# EAGLE schematic VS1053_Demo (EAGLE 9.5.1)
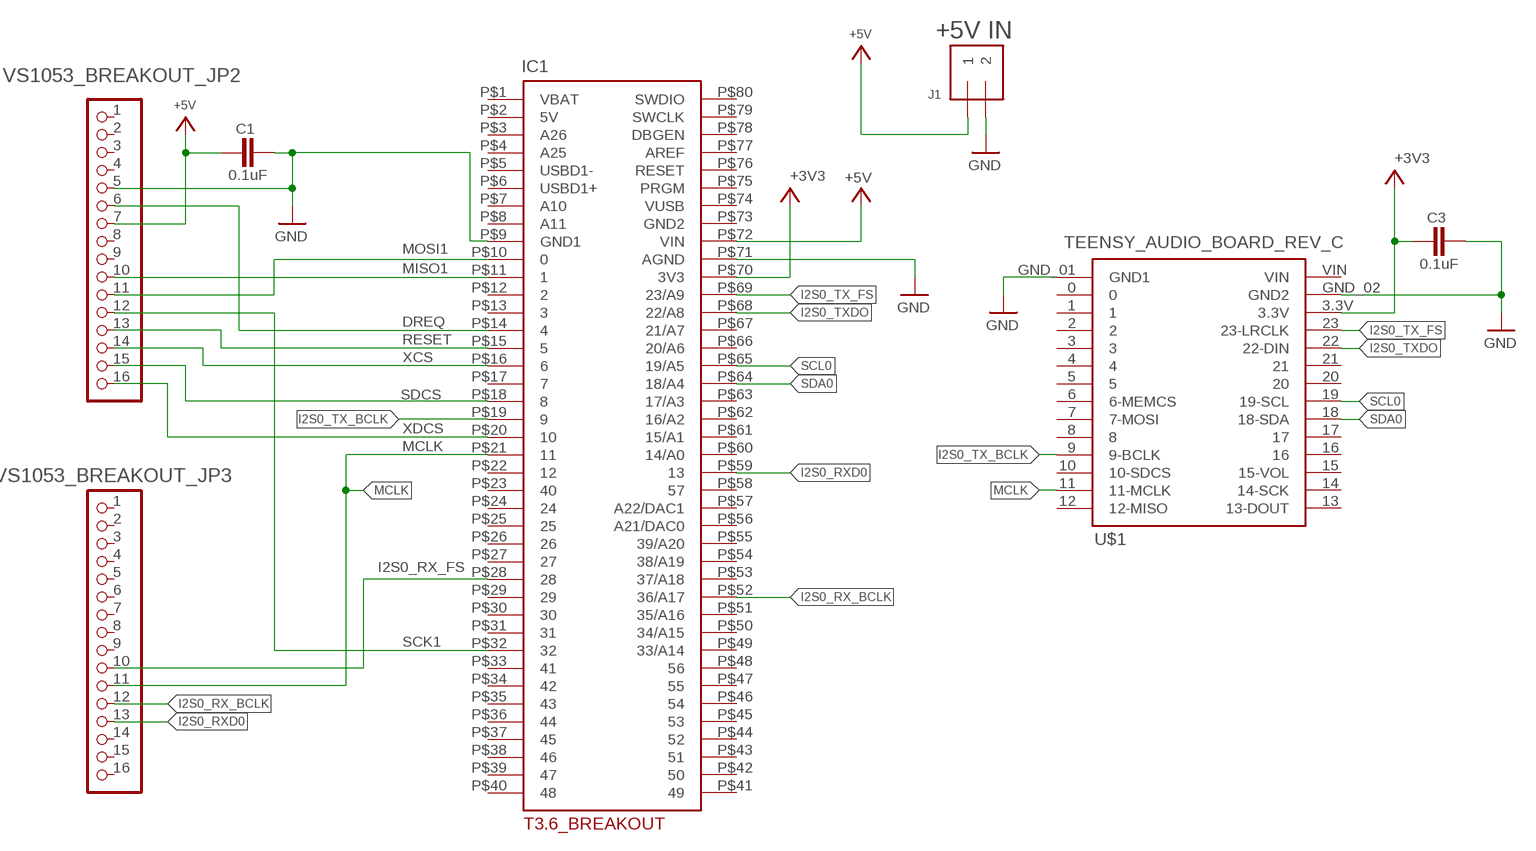
[diagram p0: schematic, sheet 1]

## Parts
C1  0.1uF  0.1UF-KIT-EZ-50V-20%  [CAP-PTH-SMALL-KIT]
C3  0.1uF  0.1UF-KIT-EZ-50V-20%  [CAP-PTH-SMALL-KIT]
IC1  T3.6_BREAKOUT  [T3.6_BREAKOUT]
J1  TERMBLOCK_1X2  [TERMBLOCK_1X2-3.5MM]
U$1  TEENSY_AUDIO_BOARD_REV_C  [TEENSY_AUDIO_BOARD]
VS1053_BREAKOUT_JP2  HEADER-1X16ROUND  [1X16_ROUND]
VS1053_BREAKOUT_JP3  HEADER-1X16ROUND  [1X16_ROUND]

## Nets
+3V3: C3.1 IC1.P$70(3V3) U$1.3.3V
+5V: C1.1 IC1.P$72(VIN) J1.1 VS1053_BREAKOUT_JP2.7
DREQ: IC1.P$14 VS1053_BREAKOUT_JP2.6
GND: C1.2 C3.2 IC1.P$9(GND1) IC1.P$71(AGND) J1.2 U$1.GND_01(GND1) U$1.GND_02(GND2) VS1053_BREAKOUT_JP2.5
I2S0_RX_BCLK: IC1.P$52(36/A17) VS1053_BREAKOUT_JP3.12
I2S0_RX_FS: IC1.P$28 VS1053_BREAKOUT_JP3.10
I2S0_RXD0: IC1.P$59 VS1053_BREAKOUT_JP3.13
I2S0_TX_BCLK: IC1.P$19 U$1.9(9-BCLK)
I2S0_TX_FS: IC1.P$69(23/A9) U$1.23(23-LRCLK)
I2S0_TXDO: IC1.P$68(22/A8) U$1.22(22-DIN)
MCLK: IC1.P$21 U$1.11(11-MCLK) VS1053_BREAKOUT_JP3.11
MISO1: IC1.P$11 VS1053_BREAKOUT_JP2.10
MOSI1: IC1.P$10 VS1053_BREAKOUT_JP2.11
RESET: IC1.P$15 VS1053_BREAKOUT_JP2.13
SCK1: IC1.P$32 VS1053_BREAKOUT_JP2.12
SCL0: IC1.P$65(19/A5) U$1.19(19-SCL)
SDA0: IC1.P$64(18/A4) U$1.18(18-SDA)
SDCS: IC1.P$18 VS1053_BREAKOUT_JP2.15
XCS: IC1.P$16 VS1053_BREAKOUT_JP2.14
XDCS: IC1.P$20 VS1053_BREAKOUT_JP2.16
Unconnected: IC1.P$1(VBAT) IC1.P$2(5V) IC1.P$3(A26) IC1.P$4(A25) IC1.P$5(USBD1-) IC1.P$6(USBD1+) IC1.P$7(A10) IC1.P$8(A11) IC1.P$12 IC1.P$13 IC1.P$17 IC1.P$22 IC1.P$23 IC1.P$24 IC1.P$25 IC1.P$26 IC1.P$27 IC1.P$29 IC1.P$30 IC1.P$31 IC1.P$33 IC1.P$34 IC1.P$35 IC1.P$36 IC1.P$37 IC1.P$38 IC1.P$39 IC1.P$40 IC1.P$41 IC1.P$42 IC1.P$43 IC1.P$44 IC1.P$45 IC1.P$46 IC1.P$47 IC1.P$48 IC1.P$49(33/A14) IC1.P$50(34/A15) IC1.P$51(35/A16) IC1.P$53(37/A18) IC1.P$54(38/A19) IC1.P$55(39/A20) IC1.P$56(A21/DAC0) IC1.P$57(A22/DAC1) IC1.P$58 IC1.P$60(14/A0) IC1.P$61(15/A1) IC1.P$62(16/A2) IC1.P$63(17/A3) IC1.P$66(20/A6) IC1.P$67(21/A7) IC1.P$73(GND2) IC1.P$74(VUSB) IC1.P$75(PRGM) IC1.P$76(RESET) IC1.P$77(AREF) IC1.P$78(DBGEN) IC1.P$79(SWCLK) IC1.P$80(SWDIO) U$1.0 U$1.1 U$1.2 U$1.3 U$1.4 U$1.5 U$1.6(6-MEMCS) U$1.7(7-MOSI) U$1.8 U$1.10(10-SDCS) U$1.12(12-MISO) U$1.13(13-DOUT) U$1.14(14-SCK) U$1.15(15-VOL) U$1.16 U$1.17 U$1.20 U$1.21 U$1.VIN VS1053_BREAKOUT_JP2.1 VS1053_BREAKOUT_JP2.2 VS1053_BREAKOUT_JP2.3 VS1053_BREAKOUT_JP2.4 VS1053_BREAKOUT_JP2.8 VS1053_BREAKOUT_JP2.9 VS1053_BREAKOUT_JP3.1 VS1053_BREAKOUT_JP3.2 VS1053_BREAKOUT_JP3.3 VS1053_BREAKOUT_JP3.4 VS1053_BREAKOUT_JP3.5 VS1053_BREAKOUT_JP3.6 VS1053_BREAKOUT_JP3.7 VS1053_BREAKOUT_JP3.8 VS1053_BREAKOUT_JP3.9 VS1053_BREAKOUT_JP3.14 VS1053_BREAKOUT_JP3.15 VS1053_BREAKOUT_JP3.16

## Notes on the sheet
- +5V IN

## Library data of the parts
C1 C3 = SparkFun-Capacitors:0.1UF: 0.1µF ceramic capacitors A capacitor is a passive two-terminal electrical component used to store electrical energy temporarily in an electric field.; PROD_ID: CAP-08370
IC1 = GFV:T3.6_BREAKOUT
J1 = microbuilder:TERMBLOCK_1X2: 3.5mm Terminal block http://www.ladyada.net/library/pcb/eaglelibrary.html
U$1 = GFV:TEENSY_AUDIO_BOARD_REV_C
VS1053_BREAKOUT_JP2 VS1053_BREAKOUT_JP3 = microbuilder:HEADER-1X16: PIN HEADER